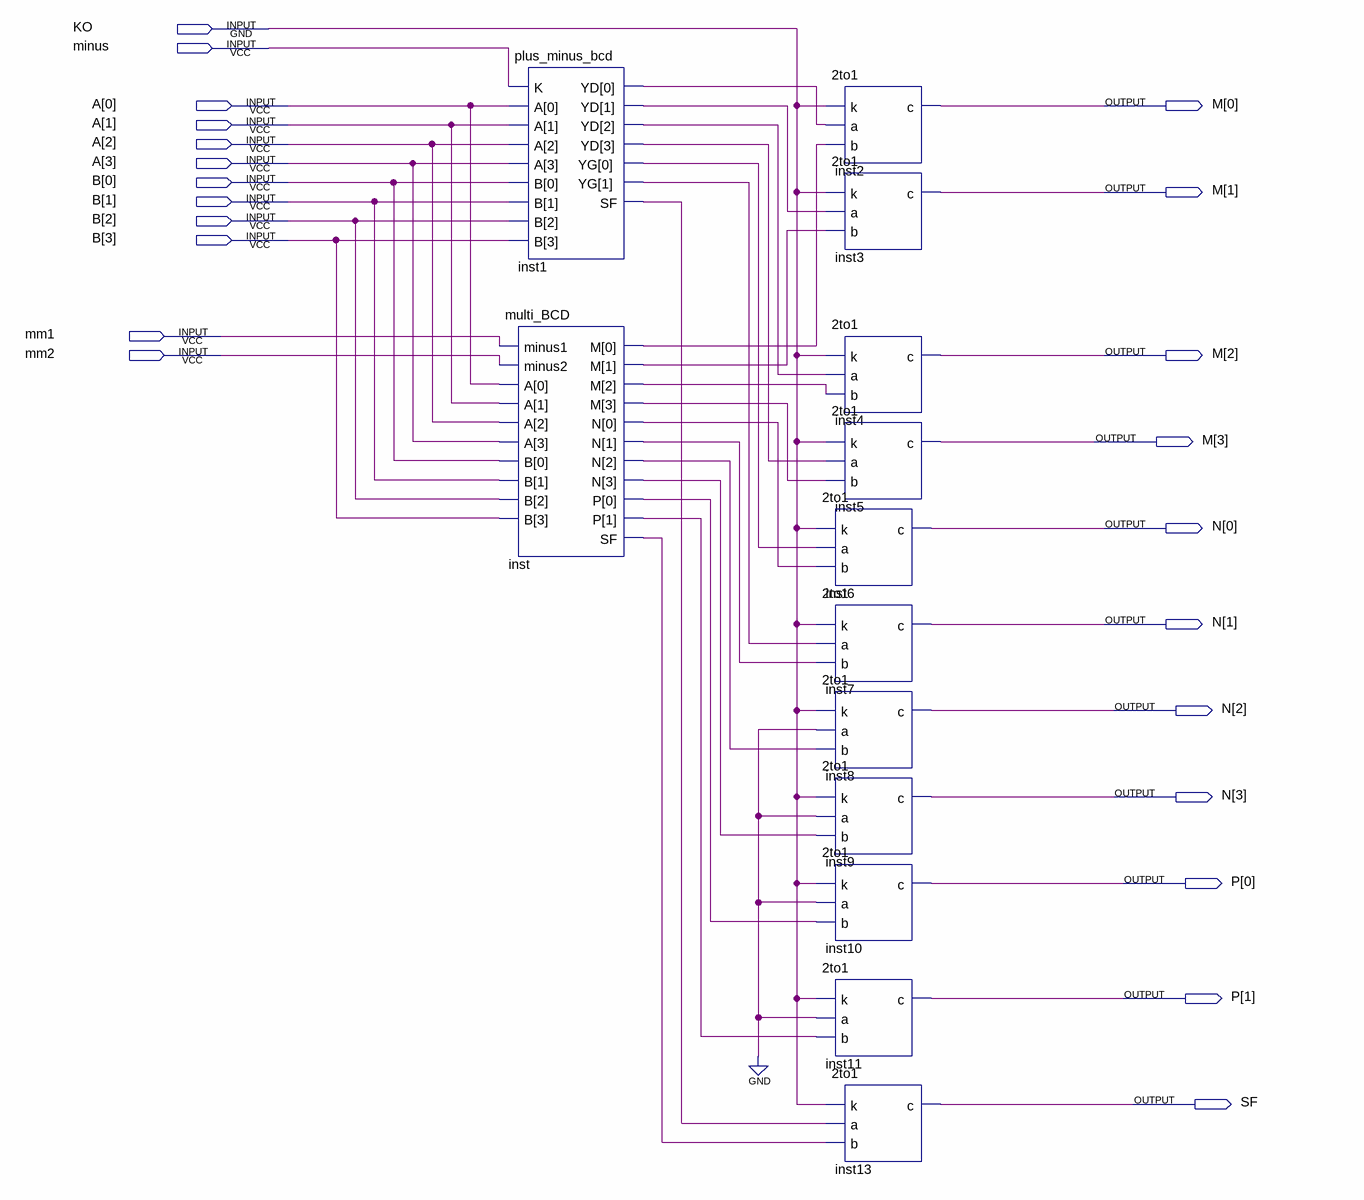
[diagram p0: schematic sheet]
// Quartus schematic caculator.bdf as structural Verilog: 13 symbols, 23 pins
module caculator (
  input  KO,
  input  minus,
  input  [3:0] A,
  input  [3:0] B,
  input  mm1,
  input  mm2,
  output [3:0] M,
  output [3:0] N,
  output [1:0] P,
  output SF
);

  wire inst1_sf, inst1_yd, inst1_yd_2, inst1_yd_3, inst1_yd_4, inst1_yg, inst1_yg_2, inst_m, inst_m_2,
       inst_m_3, inst_m_4, inst_n, inst_n_2, inst_n_3, inst_n_4, inst_p, inst_p_2, inst_sf;

  multi_BCD inst (
    .minus1(mm1), .minus2(mm2), .A(A), .B(B), .M({inst_m_4, inst_m_3, inst_m_2, inst_m}),
    .N({inst_n_4, inst_n_3, inst_n_2, inst_n}), .P({inst_p_2, inst_p}), .SF(inst_sf));
  plus_minus_bcd inst1 (
    .K(minus), .A(A), .B(B), .YD({inst1_yd_4, inst1_yd_3, inst1_yd_2, inst1_yd}),
    .YG({inst1_yg_2, inst1_yg}), .SF(inst1_sf));
  \2to1  inst2 (.k(KO), .a(inst1_yd), .b(inst_m), .c(M[0]));
  \2to1  inst3 (.k(KO), .a(inst1_yd_2), .b(inst_m_2), .c(M[1]));
  \2to1  inst4 (.k(KO), .a(inst1_yd_3), .b(inst_m_3), .c(M[2]));
  \2to1  inst5 (.k(KO), .a(inst1_yd_4), .b(inst_m_4), .c(M[3]));
  \2to1  inst6 (.k(KO), .a(inst1_yg), .b(inst_n), .c(N[0]));
  \2to1  inst7 (.k(KO), .a(inst1_yg_2), .b(inst_n_2), .c(N[1]));
  \2to1  inst8 (.k(KO), .a(1'b0), .b(inst_n_3), .c(N[2]));
  \2to1  inst9 (.k(KO), .a(1'b0), .b(inst_n_4), .c(N[3]));
  \2to1  inst10 (.k(KO), .a(1'b0), .b(inst_p), .c(P[0]));
  \2to1  inst11 (.k(KO), .a(1'b0), .b(inst_p_2), .c(P[1]));
  \2to1  inst13 (.k(KO), .a(inst1_sf), .b(inst_sf), .c(SF));
endmodule
